# Altium schematic sheet ZynqEMIO_2.SchDoc: =TITLE
size A3; DocumentNumber: 6; SheetNumber: 6; SheetTotal: 11
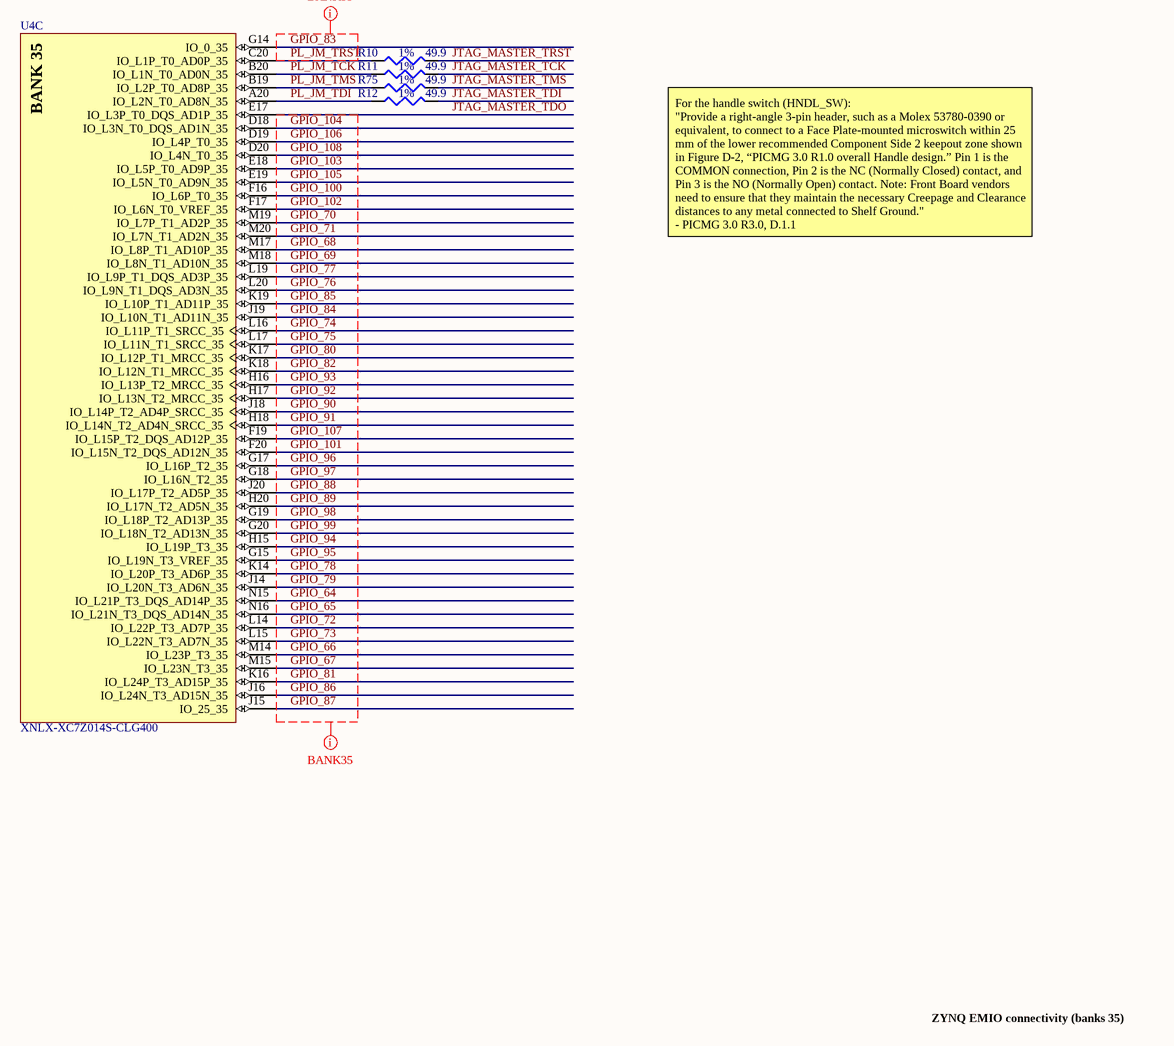
[diagram p0: ZynqEMIO_2.SchDoc]

## Parts
R10  value 49.9  Tolerance: 1%  [R0402_IPC_H]  (hidden comment: ?)
R11  value 49.9  Tolerance: 1%  [R0402_IPC_H]  (hidden comment: ?)
R12  value 49.9  Tolerance: 1%  [R0402_IPC_H]  (hidden comment: ?)
R75  value 49.9  Tolerance: 1%  [R0402_IPC_H]  (hidden comment: ?)
U4  XNLX-XC7Z014S-CLG400  [CLG400]  (part C of 9)

## Nets
GPIO_64: U4.N15(IO_L21P_T3_DQS_AD14P_35)
GPIO_65: U4.N16(IO_L21N_T3_DQS_AD14N_35)
GPIO_66: U4.M14(IO_L23P_T3_35)
GPIO_67: U4.M15(IO_L23N_T3_35)
GPIO_68: U4.M17(IO_L8P_T1_AD10P_35)
GPIO_69: U4.M18(IO_L8N_T1_AD10N_35)
GPIO_70: U4.M19(IO_L7P_T1_AD2P_35)
GPIO_71: U4.M20(IO_L7N_T1_AD2N_35)
GPIO_72: U4.L14(IO_L22P_T3_AD7P_35)
GPIO_73: U4.L15(IO_L22N_T3_AD7N_35)
GPIO_74: U4.L16(IO_L11P_T1_SRCC_35)
GPIO_75: U4.L17(IO_L11N_T1_SRCC_35)
GPIO_76: U4.L20(IO_L9N_T1_DQS_AD3N_35)
GPIO_77: U4.L19(IO_L9P_T1_DQS_AD3P_35)
GPIO_78: U4.K14(IO_L20P_T3_AD6P_35)
GPIO_79: U4.J14(IO_L20N_T3_AD6N_35)
GPIO_80: U4.K17(IO_L12P_T1_MRCC_35)
GPIO_81: U4.K16(IO_L24P_T3_AD15P_35)
GPIO_82: U4.K18(IO_L12N_T1_MRCC_35)
GPIO_83: U4.G14(IO_0_35)
GPIO_84: U4.J19(IO_L10N_T1_AD11N_35)
GPIO_85: U4.K19(IO_L10P_T1_AD11P_35)
GPIO_86: U4.J16(IO_L24N_T3_AD15N_35)
GPIO_87: U4.J15(IO_25_35)
GPIO_88: U4.J20(IO_L17P_T2_AD5P_35)
GPIO_89: U4.H20(IO_L17N_T2_AD5N_35)
GPIO_90: U4.J18(IO_L14P_T2_AD4P_SRCC_35)
GPIO_91: U4.H18(IO_L14N_T2_AD4N_SRCC_35)
GPIO_92: U4.H17(IO_L13N_T2_MRCC_35)
GPIO_93: U4.H16(IO_L13P_T2_MRCC_35)
GPIO_94: U4.H15(IO_L19P_T3_35)
GPIO_95: U4.G15(IO_L19N_T3_VREF_35)
GPIO_96: U4.G17(IO_L16P_T2_35)
GPIO_97: U4.G18(IO_L16N_T2_35)
GPIO_98: U4.G19(IO_L18P_T2_AD13P_35)
GPIO_99: U4.G20(IO_L18N_T2_AD13N_35)
GPIO_100: U4.F16(IO_L6P_T0_35)
GPIO_101: U4.F20(IO_L15N_T2_DQS_AD12N_35)
GPIO_102: U4.F17(IO_L6N_T0_VREF_35)
GPIO_103: U4.E18(IO_L5P_T0_AD9P_35)
GPIO_104: U4.D18(IO_L3N_T0_DQS_AD1N_35)
GPIO_105: U4.E19(IO_L5N_T0_AD9N_35)
GPIO_106: U4.D19(IO_L4P_T0_35)
GPIO_107: U4.F19(IO_L15P_T2_DQS_AD12P_35)
GPIO_108: U4.D20(IO_L4N_T0_35)
JTAG_MASTER_TCK: R11.1
JTAG_MASTER_TDI: R12.1
JTAG_MASTER_TDO: U4.E17(IO_L3P_T0_DQS_AD1P_35)
JTAG_MASTER_TMS: R75.1
JTAG_MASTER_TRST: R10.1
PL_JM_TCK: R11.2 U4.B20(IO_L1N_T0_AD0N_35)
PL_JM_TDI: R12.2 U4.A20(IO_L2N_T0_AD8N_35)
PL_JM_TMS: R75.2 U4.B19(IO_L2P_T0_AD8P_35)
PL_JM_TRST: R10.2 U4.C20(IO_L1P_T0_AD0P_35)

## Layout directives
net class BANK35: GPIO_64, GPIO_65, GPIO_66, GPIO_67, GPIO_68, GPIO_69, GPIO_70, GPIO_71, GPIO_72, GPIO_73, GPIO_74, GPIO_75, GPIO_76, GPIO_77, GPIO_78, GPIO_79, GPIO_80, GPIO_81, GPIO_82, GPIO_83, GPIO_84, GPIO_85, GPIO_86, GPIO_87, GPIO_88, GPIO_89, GPIO_90, GPIO_91, GPIO_92, GPIO_93, GPIO_94, GPIO_95, GPIO_96, GPIO_97, GPIO_98, GPIO_99, GPIO_100, GPIO_101, GPIO_102, GPIO_103, GPIO_104, GPIO_105, GPIO_106, GPIO_107, GPIO_108, PL_JM_TRST

## Notes on the sheet
- For the handle switch (HNDL_SW):
  "Provide a right-angle 3-pin header, such as a Molex 53780-0390 or equivalent, to connect to a Face Plate-mounted microswitch within 25 mm of the lower recommended Component Side 2 keepout zone shown in Figure D-2, “PICMG 3.0 R1.0 overall Handle design.” Pin 1 is the COMMON connection, Pin 2 is the NC (Normally Closed) contact, and Pin 3 is the NO (Normally Open) contact. Note: Front Board vendors need to ensure that they maintain the necessary Creepage and Clearance distances to any metal connected to Shelf Ground."
  - PICMG 3.0 R3.0, D.1.1
- ZYNQ EMIO connectivity (banks 35)
- Description
- Title
- Size:
- Date:
- A3
- Number:
- Time:
- Revision:
- Sheet
- of
- File:
- Author:
- (in symbol XNLX-XC7Z020-CLG400, part C) BANK 35

## Library data of the parts
R10-R12 R75 = Res: Resistor; Manufacturer: Panasonic; Part: ERJ-2RKF49R9X; INVKEY: RS0402-49R9-1/10W-1%; PackageDescription: Chip Resistor
U4 = XNLX-XC7Z020-CLG400: Manufacturer: Xilinx; Part: XC7Z014S-1CLG400C; INVKEY: ?